# EAGLE design moduloAcionamento (EAGLE 9.5.2)
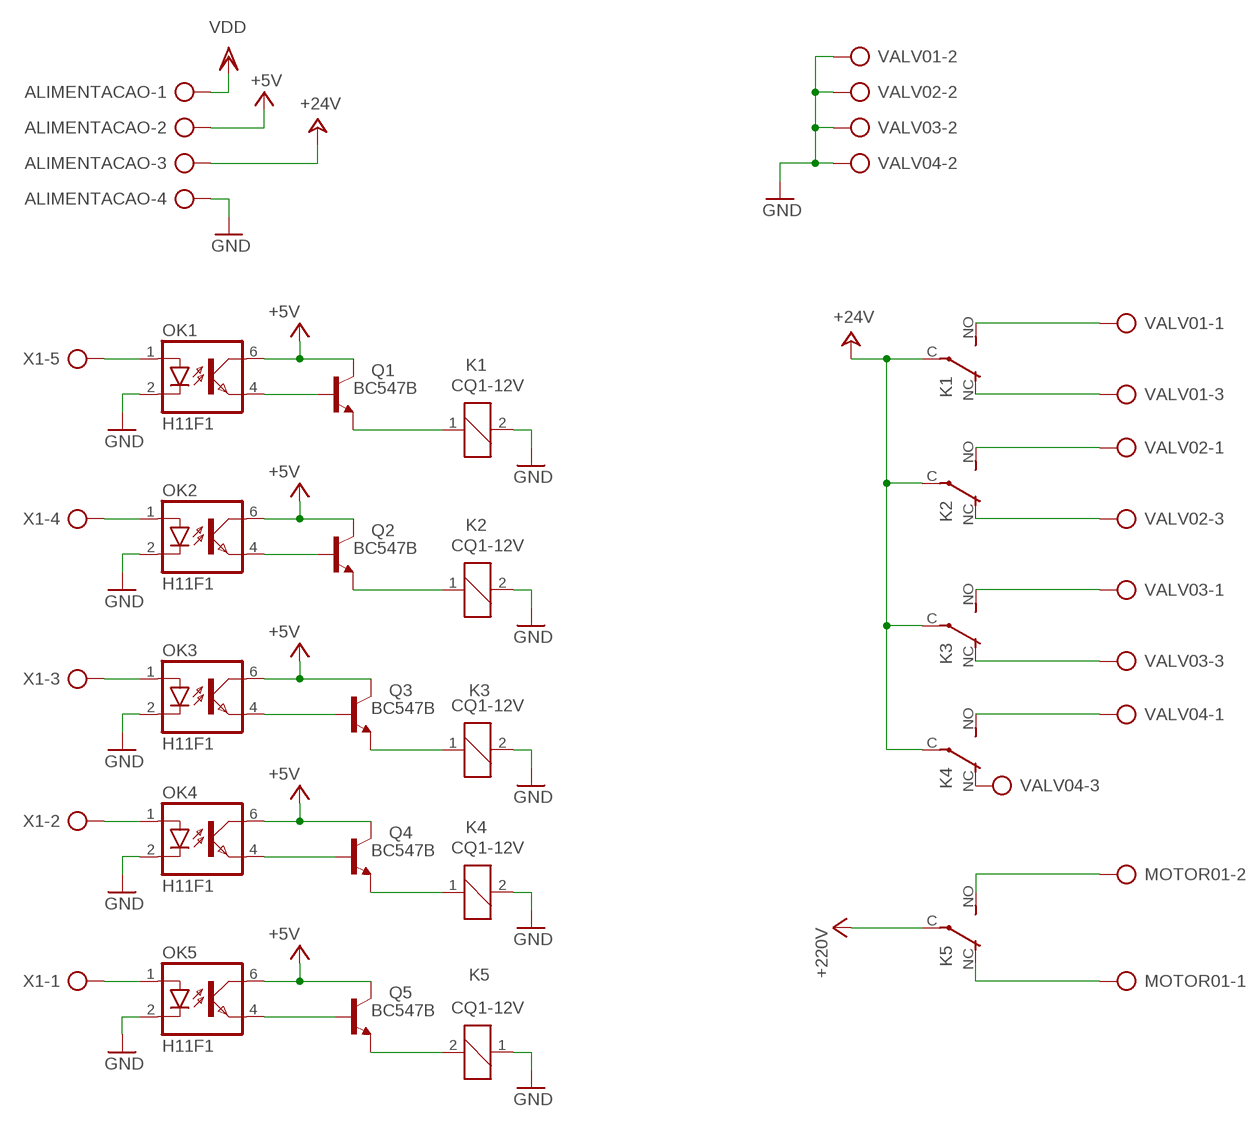
[diagram p0: schematic, sheet 1]

## Parts
ALIMENTACAO  AK500/4  [AK500/4]
K1  CQ1-12V  [CQ1]
K2  CQ1-12V  [CQ1]
K3  CQ1-12V  [CQ1]
K4  CQ1-12V  [CQ1]
K5  CQ1-12V  [CQ1]
MOTOR01  AK500/2  [AK500/2]
OK1  H11F1  [DIL05]
OK2  H11F1  [DIL05]
OK3  H11F1  [DIL05]
OK4  H11F1  [DIL05]
OK5  H11F1  [DIL05]
Q1  BC547B  [TO92]
Q2  BC547B  [TO92]
Q3  BC547B  [TO92]
Q4  BC547B  [TO92]
Q5  BC547B  [TO92]
VALV01  AK500/3  [AK500/3]
VALV02  AK500/3  [AK500/3]
VALV03  AK500/3  [AK500/3]
VALV04  AK500/3  [AK500/3]
X1  AK500/5  [AK500/5]

## Nets
+5V: ALIMENTACAO.2 K5.C(2:P) OK1.6(COL) OK2.6(COL) OK3.6(COL) OK4.6(COL) OK5.6(COL) Q1.3(C) Q2.3(C) Q3.3(C) Q4.3(C) Q5.3(C) ; supply symbol labelled +220V
+24V: ALIMENTACAO.3 K1.C(2:P) K2.C(2:P) K3.C(2:P) K4.C(2:P)
GND: ALIMENTACAO.4 K1.2 K2.2 K3.2 K4.2 K5.1 OK1.2(C) OK2.2(C) OK3.2(C) OK4.2(C) OK5.2(C) VALV01.2 VALV02.2 VALV03.2 VALV04.2
N$1: OK4.4(EMIT) Q4.2(B)
N$2: K4.1 Q4.1(E)
N$3: K3.1 Q3.1(E)
N$4: OK3.4(EMIT) Q3.2(B)
N$5: K1.1 Q1.1(E)
N$6: K2.1 Q2.1(E)
N$7: OK2.4(EMIT) Q2.2(B)
N$8: OK5.4(EMIT) Q5.2(B)
N$9: OK5.1(A) X1.1
N$10: K5.2 Q5.1(E)
N$11: OK1.4(EMIT) Q1.2(B)
N$12: OK4.1(A) X1.2
N$13: OK3.1(A) X1.3
N$14: OK2.1(A) X1.4
N$15: OK1.1(A) X1.5
N$16: K1.NC(2:O) VALV01.3
N$17: K1.NO(2:S) VALV01.1
N$18: K2.NO(2:S) VALV02.1
N$19: K2.NC(2:O) VALV02.3
N$20: K3.NO(2:S) VALV03.1
N$21: K3.NC(2:O) VALV03.3
N$22: K4.NO(2:S) VALV04.1
N$23: K4.NC(2:O) VALV04.3
N$26: K5.NO(2:S) MOTOR01.2
N$27: K5.NC(2:O) MOTOR01.1
VDD: ALIMENTACAO.1

## Library data of the parts
ALIMENTACAO = con-ptr500:AK500/4: CONNECTOR; OC_FARNELL: unknown; OC_NEWARK: unknown
K1-K5 = relay:CQ1-12V: AUTOMOTIVE QUIET RELAY NAiS Source: http://www.mew-europe.com/.. en_ds_61208_0000.pdf; OC_FARNELL: unknown; OC_NEWARK: unknown
MOTOR01 = con-ptr500:AK500/2: CONNECTOR; OC_FARNELL: unknown; OC_NEWARK: unknown
OK1-OK5 = optocoupler:H11F1: OPTO COUPLER OPTO COUPLER; OC_FARNELL: unknown; OC_NEWARK: unknown
Q1-Q5 = transistor-npn:BC547*: NPN Transistor
VALV01-VALV04 = con-ptr500:AK500/3: CONNECTOR; OC_FARNELL: unknown; OC_NEWARK: unknown
X1 = con-ptr500:AK500/5: CONNECTOR; OC_FARNELL: unknown; OC_NEWARK: unknown

## Board
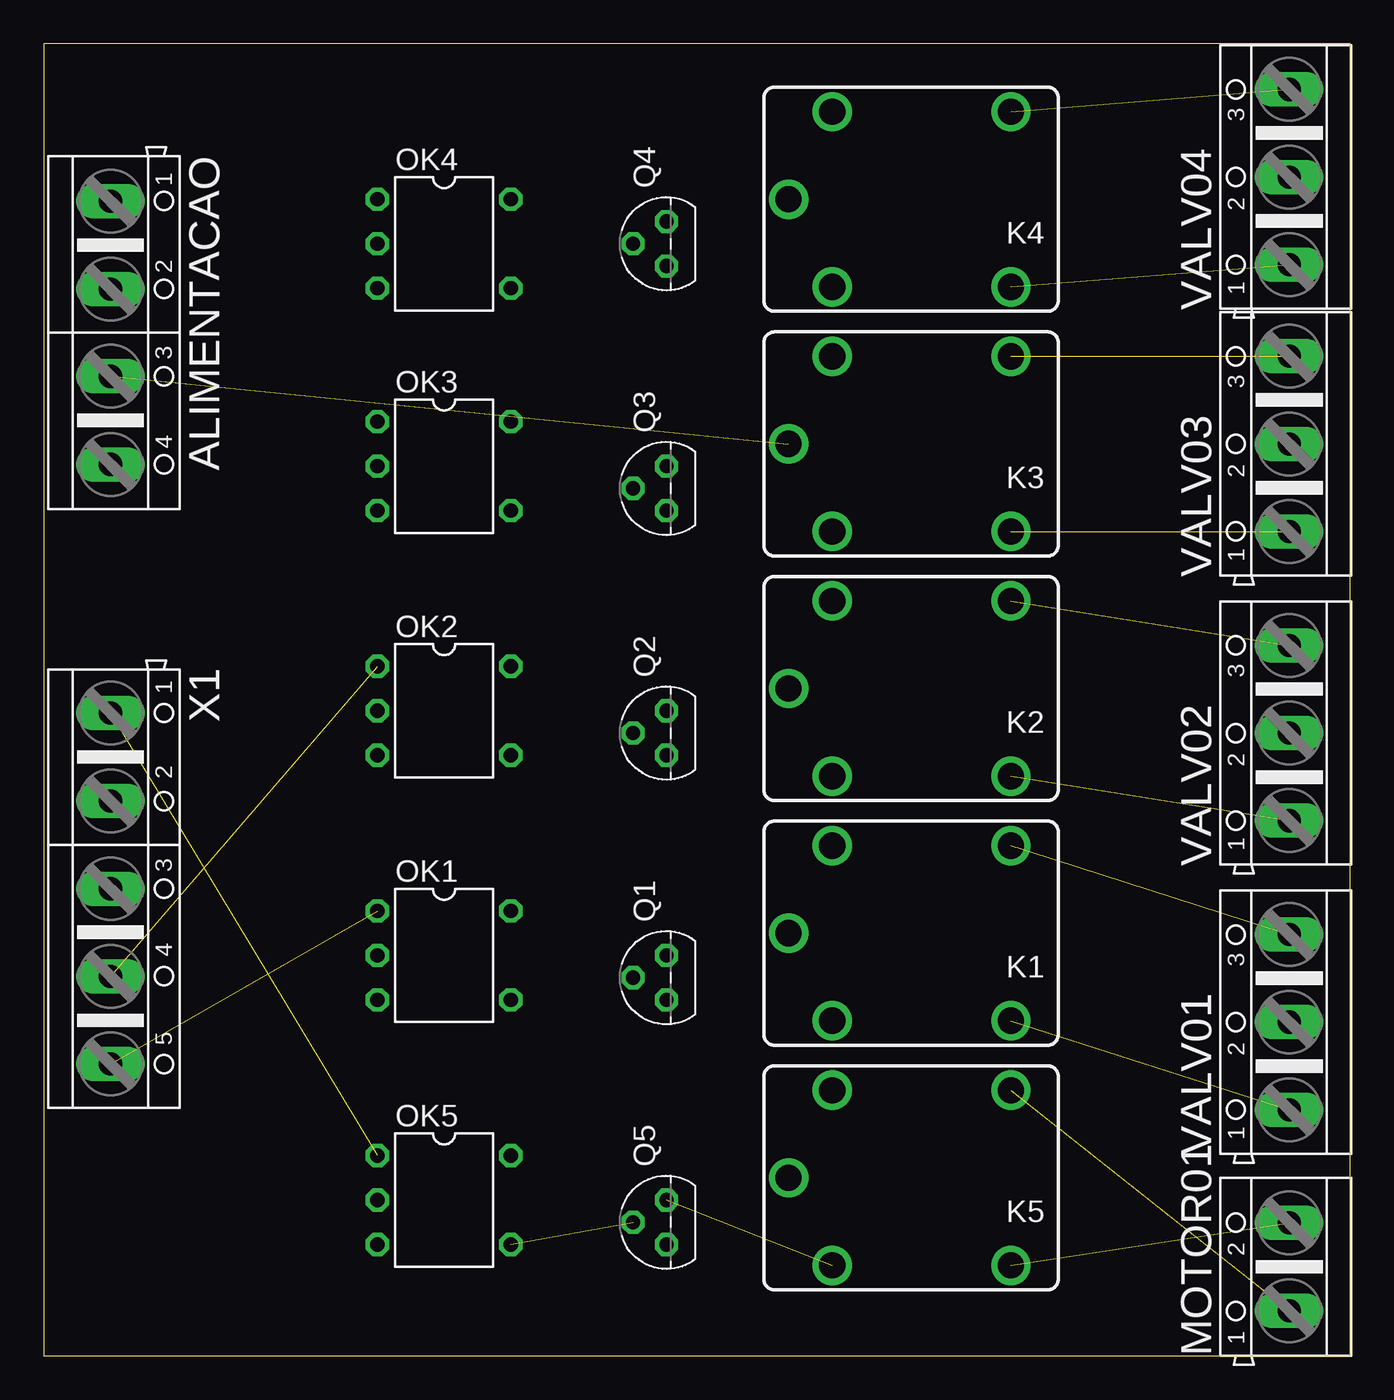
[diagram p1: board, top side]
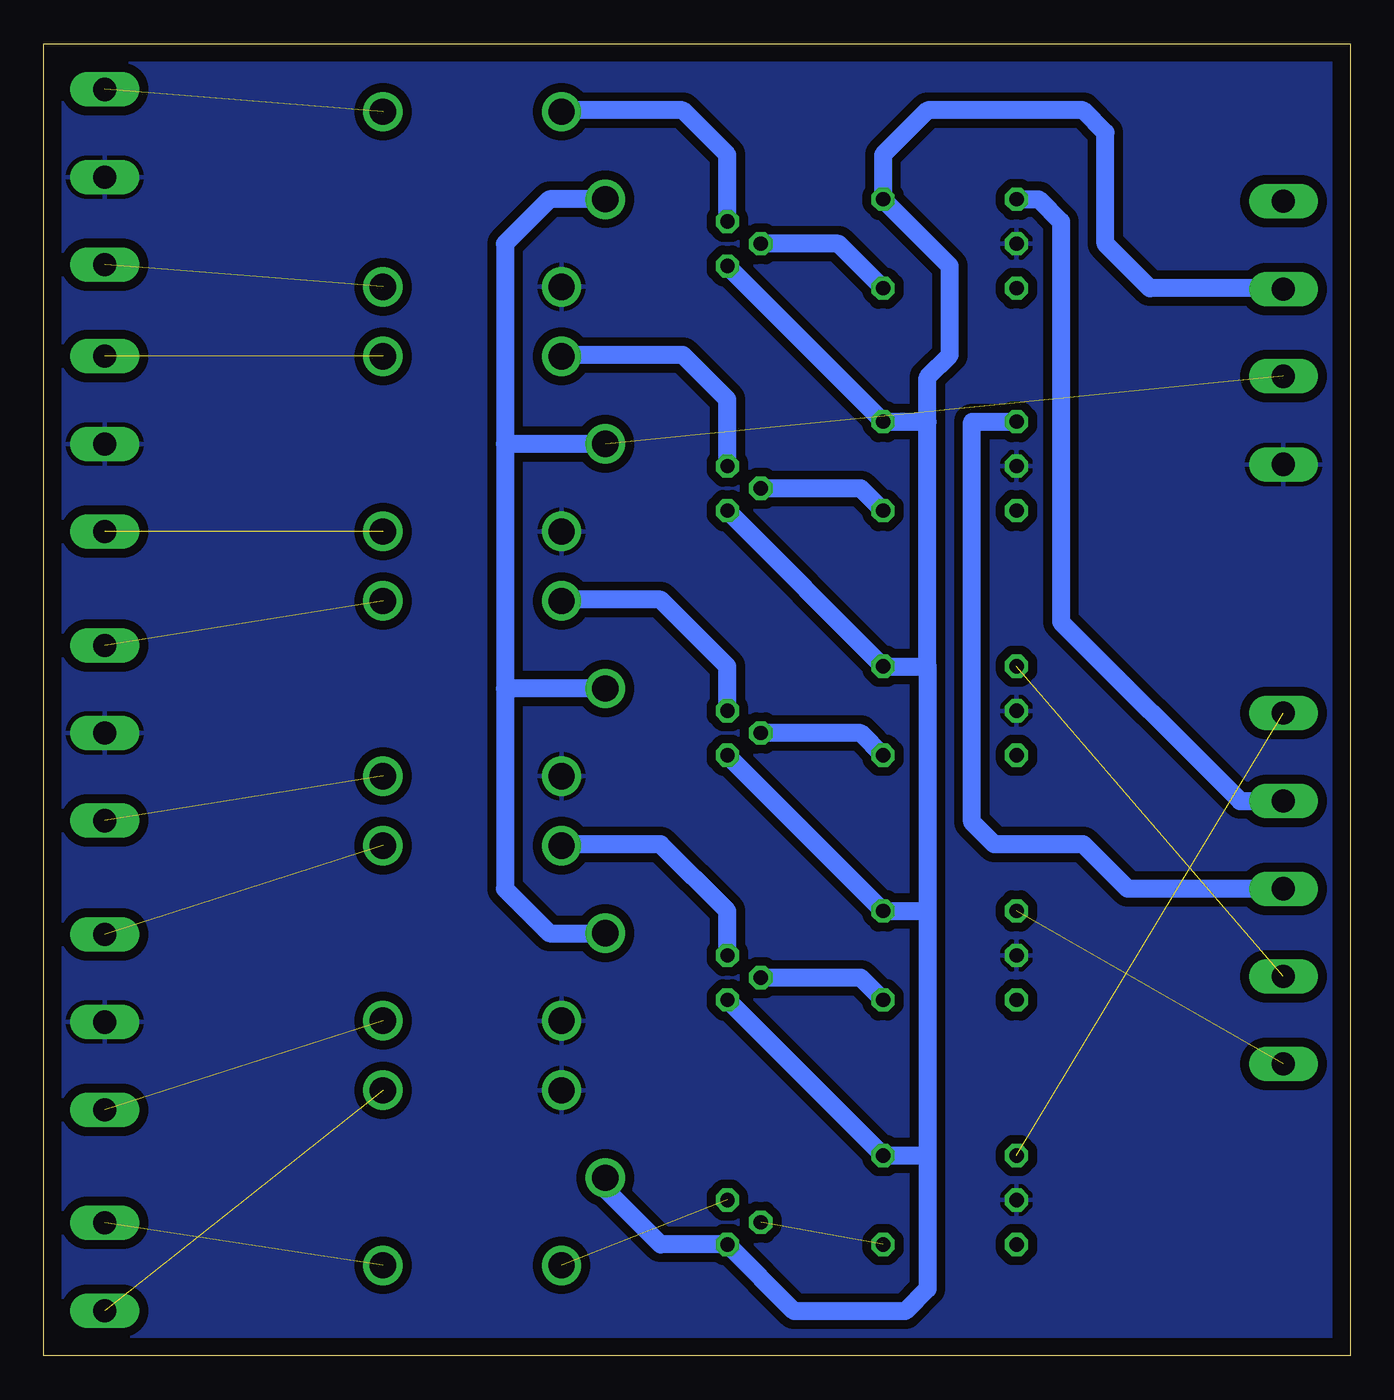
[diagram p2: board, bottom side, seen from below]

Size 74.6 x 74.92 mm. Coordinates in mm from the lower left corner, seen from the top.
Outline: 0,0 74.6,0 74.6,74.92 0,74.92 0,0
Copper layers (1*16): Top 0.035mm / dielectric 1.5mm / Bottom 0.035mm
Design rules "default *": minimum track width 6mil, minimum drill 0.35mm, track to track 20mil, track to pad 20mil, pad to pad 20mil, via to via 20mil, smd to smd 6mil, copper to edge 40mil, drill to drill 6mil, minimum pad ring 10mil, minimum via ring 8mil, stop-mask expansion 4mil, vias tented up to drill 0mil, thermal gap 10mil

### Footprints (pad centres in the part's own frame; a part is rotated, then mirrored left to right if it is on the bottom)
AK500/4 = drill 1.321 long: 1 -7.518,0; 2 -2.489,0; 3 2.489,0; 4 7.518,0
CQ1 = drill 1.5: 1 4.5,-5; 2 4.5,5; C 7,0; NC -5.7,-5; NO -5.7,5
AK500/2 = drill 1.321 long: 1 -2.515,0; 2 2.515,0
DIL05 = drill 0.813 octagon: 1 -2.54,-3.81; 2 0,-3.81; 3 2.54,-3.81; 4 2.54,3.81; 6 -2.54,3.81
TO92 = drill 0.813 octagon: 1 1.27,0; 2 0,1.905; 3 -1.27,0
AK500/3 = drill 1.321 long: 1 -5.004,0; 2 0,0; 3 5.004,0
AK500/5 = drill 1.321 long: 1 -10.033,0; 2 -5.004,0; 3 0,0; 4 5.004,0; 5 10.008,0

### Placement (x,y rotation side)
ALIMENTACAO  3.81,58.42 270 top
K1  49.53,24.13 180 top
K2  49.53,38.1 180 top
K3  49.53,52.07 180 top
K4  49.53,66.04 180 top
K5  49.53,10.16 180 top
MOTOR01  71.12,5.08 90 top
OK1  22.86,22.86 270 top
OK2  22.86,36.83 270 top
OK3  22.86,50.8 270 top
OK4  22.86,63.5 270 top
OK5  22.86,8.89 270 top
Q1  35.56,21.59 90 top
Q2  35.56,35.56 90 top
Q3  35.56,49.53 90 top
Q4  35.56,63.5 90 top
Q5  35.56,7.62 90 top
VALV01  71.12,19.05 90 top
VALV02  71.12,35.56 90 top
VALV03  71.12,52.07 90 top
VALV04  71.12,67.31 90 top
X1  3.81,26.67 270 top

### Tracks (layer width: path | path; a pad name or v marks a point on that pad's centre or on a via)
+5V
  Bottom 1.016: ALIMENTACAO.2 3.86,60.96 11.43,60.96 13.97,63.5 13.97,69.85 15.24,71.12 24.13,71.12 26.67,68.58 OK4.6 22.86,62.23 22.86,57.15 24.13,55.88 24.13,53.34 | Q4.3 OK3.6 24.13,53.34 | 24.13,39.37 OK2.6 Q3.3 | 24.13,39.37 24.13,53.34 | 24.13,39.37 24.13,25.4 | 24.13,25.4 24.13,11.43 | 24.13,11.43 24.13,3.81 25.4,2.54 31.75,2.54 Q5.3 39.37,6.35 42.53,9.51 K5.C | 24.13,11.43 OK5.6 Q1.3 | 24.13,25.4 OK1.6 Q2.3
+24V  (1 unrouted)
  Bottom 1.016: K4.C 45.72,66.04 48.26,63.5 48.26,52.07 | 48.26,52.07 48.26,38.1 | 48.26,38.1 48.26,26.67 45.72,24.13 K1.C 41.91,24.13 | K2.C 48.26,38.1 | K3.C 48.26,52.07
GND
  pour Bottom: 0,74.93 0,0 74.93,0 74.93,74.93
N$1
  Bottom 1.016: OK4.4 29.21,63.5 Q4.2
N$2
  Bottom 1.016: Q4.1 35.56,68.58 38.1,71.12 44.95,71.12 K4.1
N$3
  Bottom 1.016: Q3.1 35.56,54.61 38.1,57.15 44.95,57.15 K3.1
N$4
  Bottom 1.016: OK3.4 27.94,49.53 Q3.2
N$5
  Bottom 1.016: Q1.1 35.56,25.4 39.37,29.21 44.95,29.21 K1.1
N$6
  Bottom 1.016: Q2.1 35.56,39.37 39.37,43.18 44.95,43.18 K2.1
N$7
  Bottom 1.016: OK2.4 27.94,35.56 Q2.2
N$8  (1 unrouted)
N$9  (1 unrouted)
N$10  (1 unrouted)
N$11
  Bottom 1.016: OK1.4 27.94,21.59 Q1.2
N$12
  Bottom 1.016: OK4.1 17.78,66.04 16.51,64.77 16.51,41.91 6.27,31.67 X1.2
N$13
  Bottom 1.016: OK3.1 21.59,53.34 21.59,30.48 20.32,29.21 15.24,29.21 12.7,26.67 X1.3
N$14  (1 unrouted)
N$15  (1 unrouted)
N$16  (1 unrouted)
N$17  (1 unrouted)
N$18  (1 unrouted)
N$19  (1 unrouted)
N$20  (1 unrouted)
N$21  (1 unrouted)
N$22  (1 unrouted)
N$23  (1 unrouted)
N$26  (1 unrouted)
N$27  (1 unrouted)